# Altium schematic sheet Bike_Light_PCB_2017_Power.SchDoc
size A4
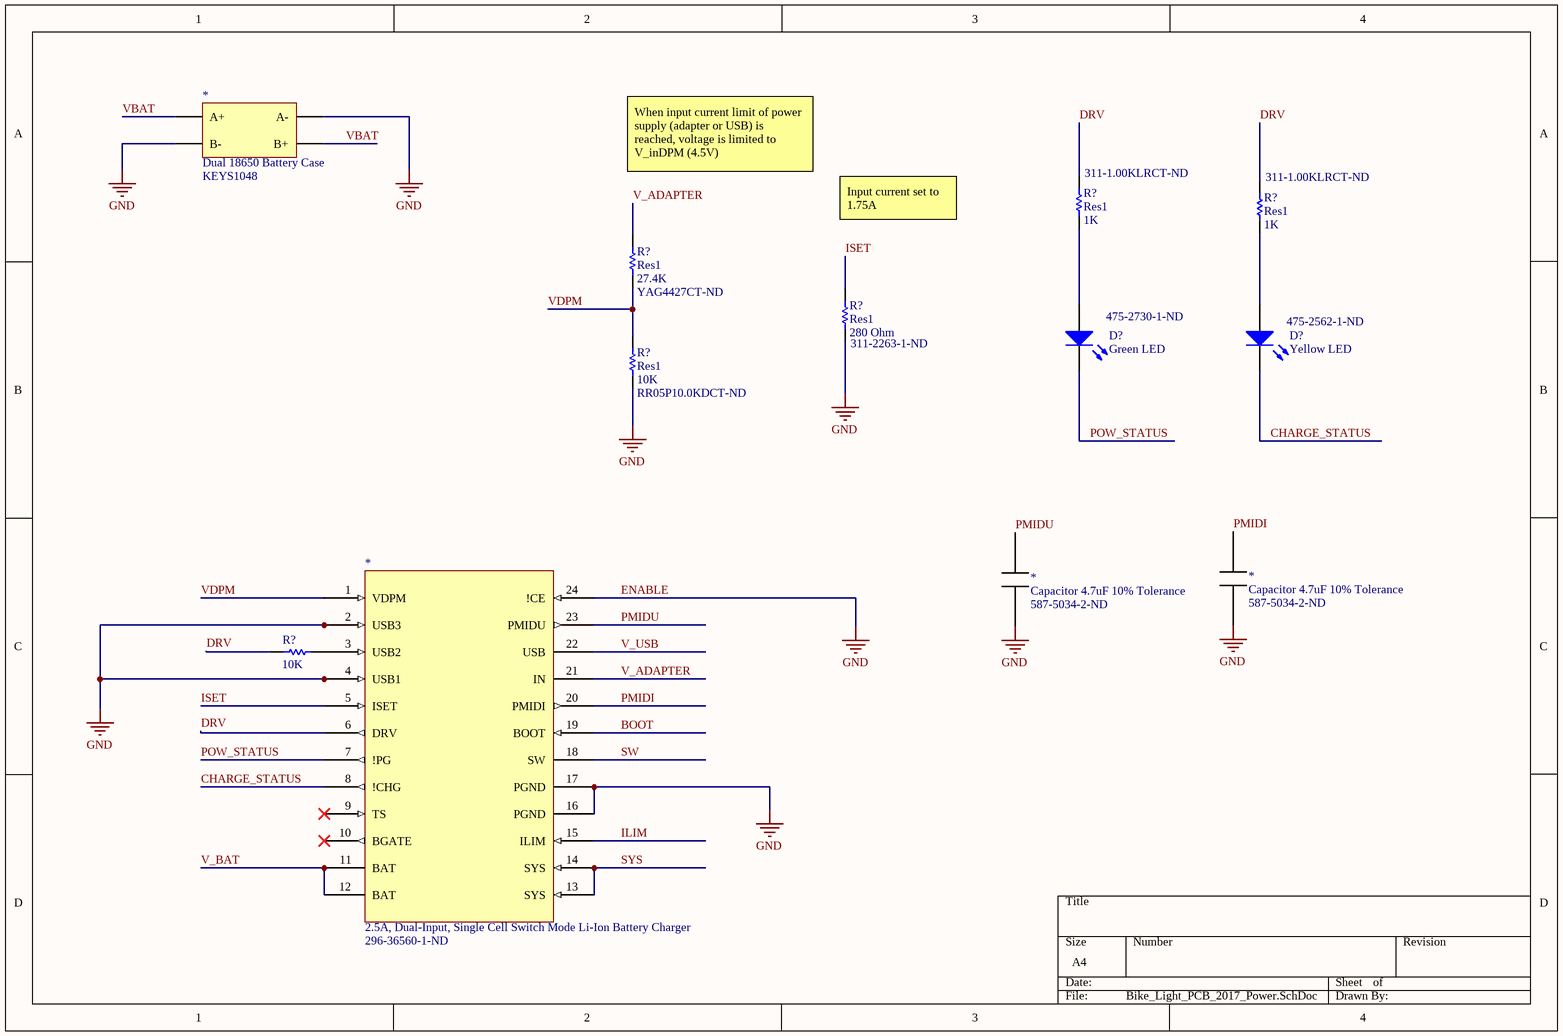
[diagram p0: Bike_Light_PCB_2017_Power.SchDoc]

## Parts
(Parts that share a designator on the sheet are numbered #1, #2 ... from top to bottom, then left to right.)
*#1  Dual 18650 Battery Case  Supplier Part Number 1: KEYS1048
*#2  Capacitor 4.7uF 10% Tolerance  Supplier Part Number 1: 587-5034-2-ND
*#3  Capacitor 4.7uF 10% Tolerance  Supplier Part Number 1: 587-5034-2-ND
*#4  2.5A, Dual-Input, Single Cell Switch Mode Li-Ion Battery Charger  Supplier Part Number 1: 296-36560-1-ND
D?#1  Green LED  Supplier Part Number 1: 475-2730-1-ND  [LED-0]
D?#2  Yellow LED  Supplier Part Number 1: 475-2562-1-ND  [LED-0]
R?#1  Res1  value 1K  Supplier Part Number 1: 311-1.00KLRCT-ND  [AXIAL-0.3]
R?#2  Res1  value 1K  Supplier Part Number 1: 311-1.00KLRCT-ND  [AXIAL-0.3]
R?#3  Res1  value 27.4K  Supplier Part Number 1: YAG4427CT-ND  [AXIAL-0.3]
R?#4  Res1  value 280 Ohm  Supplier Part Number 1: 311-2263-1-ND  [AXIAL-0.3]
R?#5  Res1  value 10K  Supplier Part Number 1: RR05P10.0KDCT-ND  [AXIAL-0.3]
R?#6  value 10K  [AXIAL-0.3]  (hidden comment: Res1)

## Nets
ENABLE: *#1.?1(A-) *#1.?4(B-) *#2.0 *#3.0 *#4.2(USB3) *#4.4(USB1) *#4.16(PGND) *#4.17(PGND) *#4.24(!CE) R?#4.1 R?#5.1  [also labelled GND]
BOOT: *#4.19(BOOT)
CHARGE_STATUS: *#4.8(!CHG) D?#2.2(K)
DRV: *#4.6(DRV) R?#1.2 R?#2.2 R?#6.2
ILIM: *#4.15(ILIM)
ISET: *#4.5(ISET) R?#4.2
PMIDI: *#3.1 *#4.20(PMIDI)
PMIDU: *#2.1 *#4.23(PMIDU)
POW_STATUS: *#4.7(!PG) D?#1.2(K)
SW: *#4.18(SW)
SYS: *#4.13(SYS) *#4.14(SYS)
V_ADAPTER: *#4.21(IN) R?#3.2
V_BAT: *#4.11(BAT) *#4.12(BAT)
V_USB: *#4.22(USB)
VBAT: *#1.?2(B+) *#1.?3(A+)
VDPM: *#4.1(VDPM) R?#3.1 R?#5.2
Net*#4_3: *#4.3(USB2) R?#6.1
NetD?#1_1: D?#1.1(A) R?#1.1
NetD?#2_1: D?#2.1(A) R?#2.1

Not connected (* = marked no-connect by the designer): *#4 9(TS)* 10(BGATE)*

## Notes on the sheet
- When input current limit of power supply (adapter or USB) is reached, voltage is limited to V_inDPM (4.5V)
- Input current set to 1.75A

## Library data of the parts
D?#1 D?#2 = LED0: Typical INFRARED GaAs LED; Published: 8-Jun-2000; LatestRevisionDate: 08-Jul-2005; LatestRevisionNote: Mech Layer 1 removed.; PackageReference: LED-0; Publisher: Altium Limited; PackageDescription: LED; 2 Leads; Supplier 1: Digi-Key
R?#1-R?#6 = Res1: Resistor; Published: 8-Jun-2000; LatestRevisionDate: 17-Jul-2002; LatestRevisionNote: Re-released for DXP Platform.; PackageReference: AXIAL-0.3; Publisher: Altium Limited; PackageDescription: Axial Device, Thru-Hole; 2 Leads; 0.3 in Pin Spacing; Supplier 1: Digi-Key
  R?#6: Supplier Part Number 1: RR05P10.0KDCT-ND
*#1 = Dual 18650 Battery Case: Supplier 1: TME
*#2 *#3 = Capacitor 4.7uF 10% Tolerance: Supplier 1: Digi-Key
*#4 = 2.5A, Dual-Input, Single Cell Switch Mode Li-Ion Battery Charger: Supplier 1: Digi-Key